# Altium schematic sheet 调理电路.SchDoc
size A4 portrait
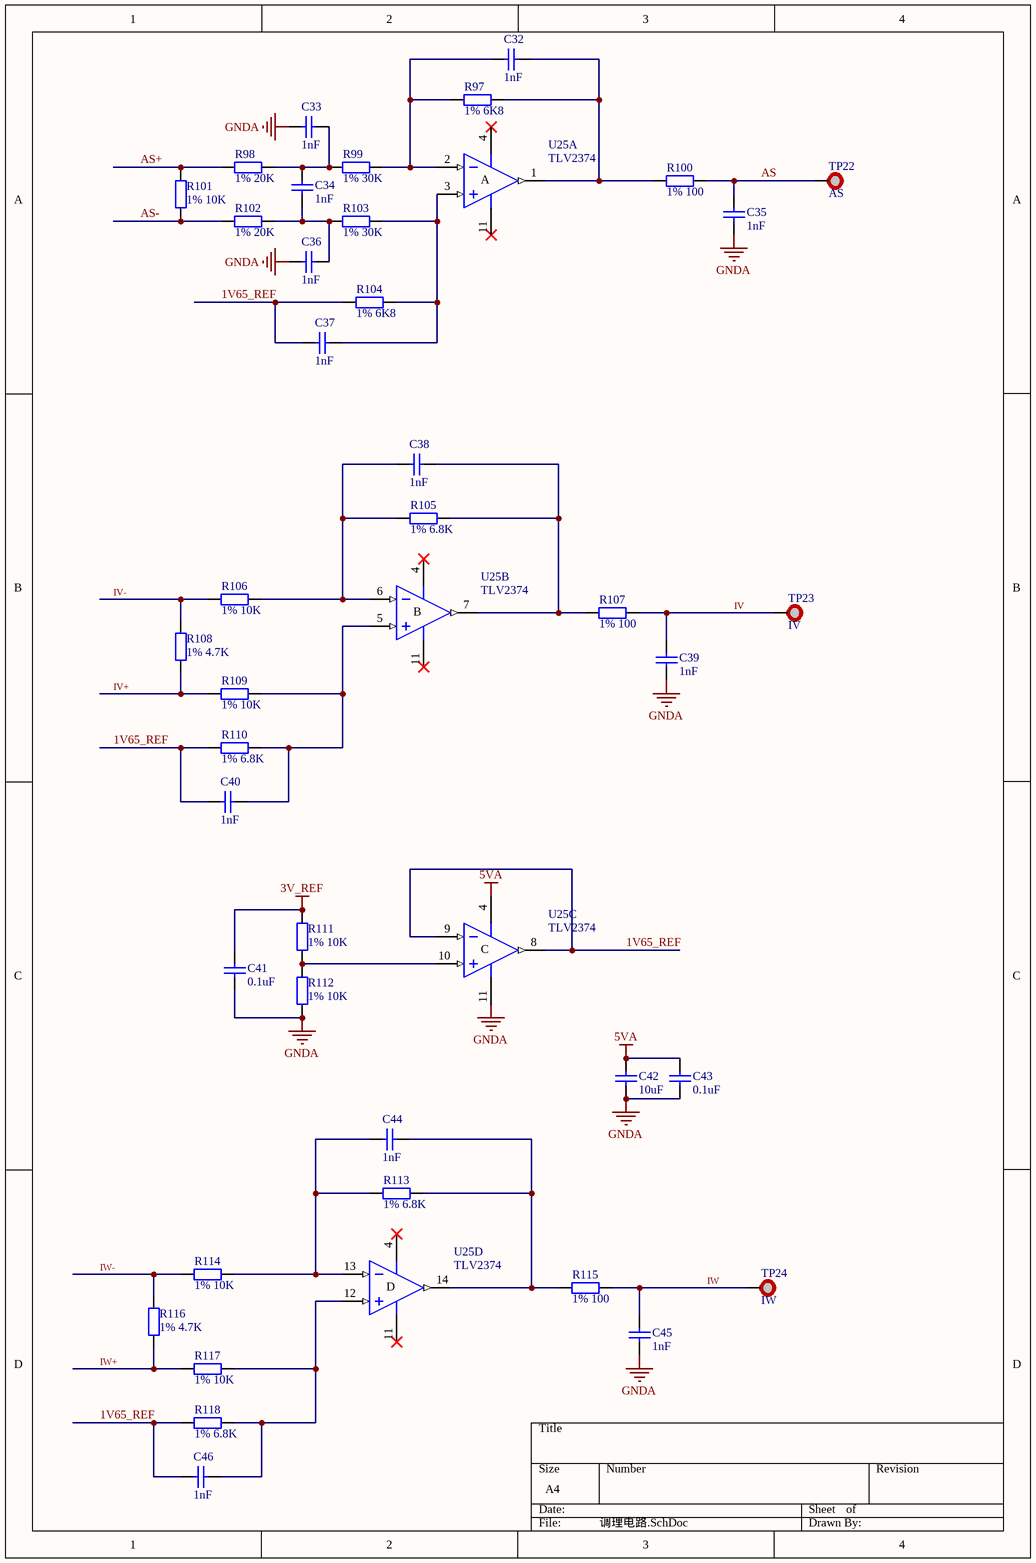
[diagram p0: 调理电路.SchDoc]

## Parts
C32  1nF  [C SMD 0603]
C33  1nF  [C SMD 0603]
C34  1nF  [C SMD 0603]
C35  1nF  [C SMD 0603]
C36  1nF  [C SMD 0603]
C37  1nF  [C SMD 0603]
C38  1nF  [C SMD 0603]
C39  1nF  [C SMD 0603]
C40  1nF  [C SMD 0603]
C41  0.1uF  [C SMD 0603]
C42  10uF  [C SMD 1206]
C43  0.1uF  [C SMD 0603]
C44  1nF  [C SMD 0603]
C45  1nF  [C SMD 0603]
C46  1nF  [C SMD 0603]
R97  1% 6K8  [R SMD 0603 1%]
R98  1% 20K  [R SMD 0603 1%]
R99  1% 30K  [R SMD 0603 1%]
R100  1% 100  [R SMD 0603 1%]
R101  1% 10K  [R SMD 0603 1%]
R102  1% 20K  [R SMD 0603 1%]
R103  1% 30K  [R SMD 0603 1%]
R104  1% 6K8  [R SMD 0603 1%]
R105  1% 6.8K  [R SMD 0603 1%]
R106  1% 10K  [R SMD 0603 1%]
R107  1% 100  [R SMD 0603 1%]
R108  1% 4.7K  [R SMD 0603 1%]
R109  1% 10K  [R SMD 0603 1%]
R110  1% 6.8K  [R SMD 0603 1%]
R111  1% 10K  [R SMD 0603 1%]
R112  1% 10K  [R SMD 0603 1%]
R113  1% 6.8K  [R SMD 0603 1%]
R114  1% 10K  [R SMD 0603 1%]
R115  1% 100  [R SMD 0603 1%]
R116  1% 4.7K  [R SMD 0603 1%]
R117  1% 10K  [R SMD 0603 1%]
R118  1% 6.8K  [R SMD 0603 1%]
TP22  AS  [测点]
TP23  IV  [测点]
TP24  IW  [测点]
U25  TLV2374  [NSO14_N]  (parts A,B,C,D of 4)

## Nets
3V_REF: C41.2 R111.2
5VA: C42.2 C43.2 U25.4(V+)
GNDA: C33.1 C35.1 C36.1 C39.1 C41.1 C42.1 C43.1 C45.1 R112.1 U25.11(V-)
1V65_REF: C37.1 C40.1 C46.1 R104.1 R110.2 R118.2 U25.8(OUT) U25.9(IN-)
AS: C35.2 R100.2 TP22.1
AS+: R98.1 R101.1
AS-: R101.2 R102.1
IV: C39.2 R107.2 TP23.1
IV+: R108.2 R109.2
IV-: R106.2 R108.1
IW: C45.2 R115.2 TP24.1
IW+: R116.2 R117.2
IW-: R114.2 R116.1
NetC32_1: C32.1 R97.1 R99.2 U25.2(IN-)
NetC32_2: C32.2 R97.2 R100.1 U25.1(OUT)
NetC33_2: C33.2 C34.1 R98.2 R99.1
NetC34_2: C34.2 C36.2 R102.2 R103.1
NetC37_2: C37.2 R103.2 R104.2 U25.3(IN+)
NetC38_1: C38.1 R105.2 R106.1 U25.6(IN-)
NetC38_2: C38.2 R105.1 R107.1 U25.7(OUT)
NetC40_2: C40.2 R109.1 R110.1 U25.5(IN+)
NetC44_1: C44.1 R113.2 R114.1 U25.13(IN-)
NetC44_2: C44.2 R113.1 R115.1 U25.14(OUT)
NetC46_2: C46.2 R117.1 R118.1 U25.12(IN+)
NetR111_1: R111.1 R112.2 U25.10(IN+)

## Notes on the sheet
- (in symbol OPA4130PA, part A) A
- (in symbol OPA4130PA, part B) B
- (in symbol OPA4130PA, part C) C
- (in symbol OPA4130PA, part D) D

## Library data of the parts
C32-C40 C44-C46 = Cap: Capacitor; Value: 0.1uF; Published: 8-Jun-2000; LatestRevisionDate: 17-Jul-2002; LatestRevisionNote: Re-released for DXP Platform.; PackageReference: RAD-0.3; Publisher: Altium Limited; PackageDescription: Radial Cap, Thru-Hole; 2 Leads; 0.3 in Pin Spacing
C41-C43 = Cap: Capacitor; Value: 104; Published: 8-Jun-2000; LatestRevisionDate: 17-Jul-2002; LatestRevisionNote: Re-released for DXP Platform.; PackageReference: RAD-0.3; Publisher: Altium Limited
R97-R118 = Res2: Resistor; Value: 1K; Published: 8-Jun-2000; LatestRevisionDate: 17-Jul-2002; LatestRevisionNote: Re-released for DXP Platform.; PackageReference: AXIAL-0.4; Publisher: Altium Limited
TP22-TP24 = TEST_POINT
U25 = OPA4130PA: Low-Power, Precision FET-Input Operational Amplifiers; Published: 8-Jun-2000; LatestRevisionDate: 06-Jun-2005; LatestRevisionNote: Stylized 3D Model Added.; DatasheetVersion: May-1998; PackageVersion: 1996/1997; PackageReference: 010G; Publisher: Altium Limited; PackageDescription: DIP; 14 Leads; Row Spacing 7.62 mm; Pitch 2.54 mm; ComponentLink1Description: Manufacturer Link; ComponentLink1URL: http://www.ti.com/; ComponentLink2Description: Datasheet; ComponentLink2URL: http://www-s.ti.com/sc/ds/OPA130.pdf